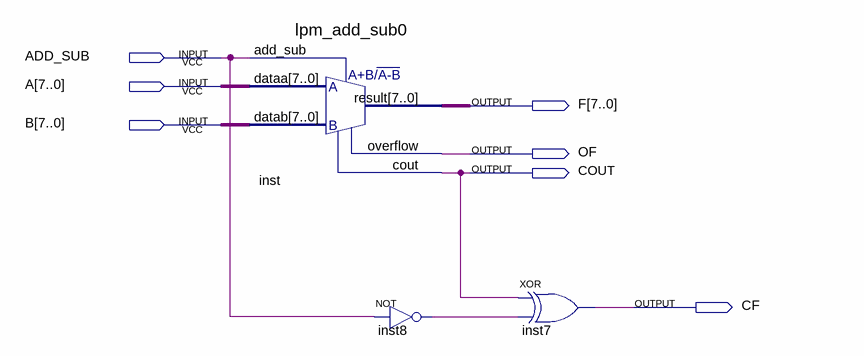
[diagram p0: schematic sheet]
// Quartus schematic ADD_SUB.bdf as structural Verilog: 3 symbols, 7 pins
module ADD_SUB (
  input  ADD_SUB,
  input  [7:0] A,
  input  [7:0] B,
  output [7:0] F,
  output OF,
  output COUT,
  output CF
);

  wire inst8_out;

  lpm_add_sub0 inst (.dataa(A), .datab(B), .add_sub(ADD_SUB), .result(F), .overflow(OF), .cout(COUT));
  not inst8 (inst8_out, ADD_SUB);
  xor inst7 (CF, COUT, inst8_out);
endmodule
